# Altium schematic sheet Main.SchDoc
size A4; SheetNumber: 2; SheetTotal: 8
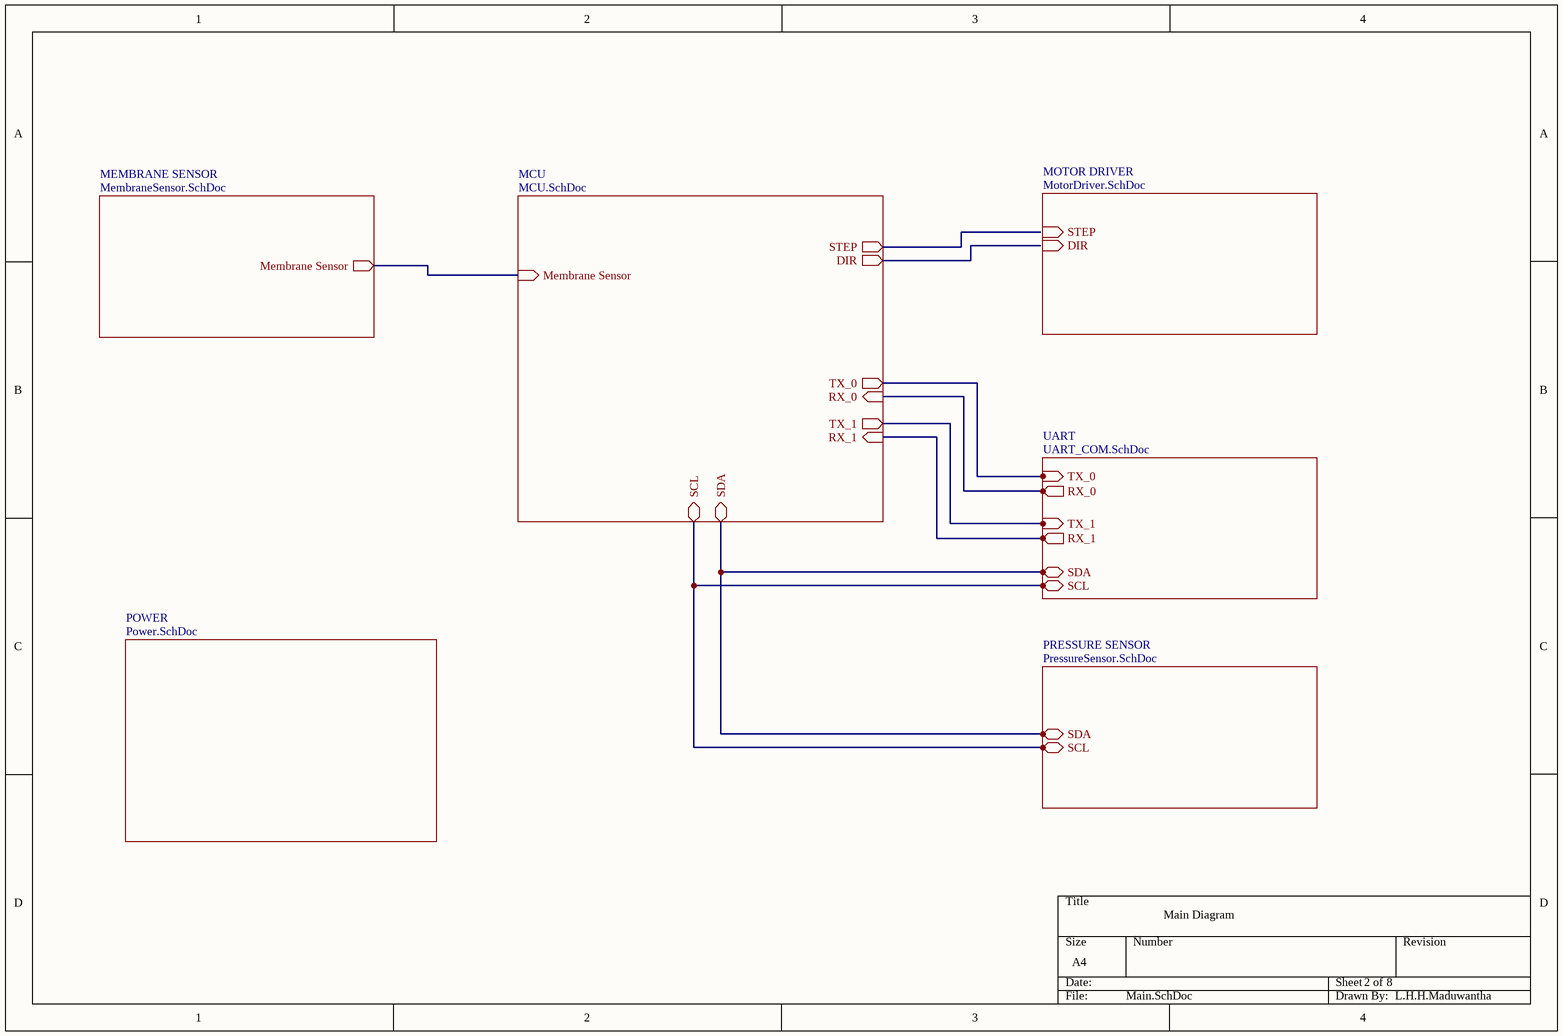
[diagram p0: Main.SchDoc]

## Sub-sheets
MCU = MCU.SchDoc: TX_1 (out), RX_1 (in), TX_0 (out), RX_0 (in), SCL (bidir), SDA (bidir), STEP (out), DIR (out), Membrane Sensor (in)
MEMBRANE SENSOR = MembraneSensor.SchDoc: Membrane Sensor (out)
MOTOR DRIVER = MotorDriver.SchDoc: STEP (in), DIR (in)
POWER = Power.SchDoc: no entries
PRESSURE SENSOR = PressureSensor.SchDoc: SDA (bidir), SCL (bidir)
UART = UART_COM.SchDoc: TX_0 (in), RX_0 (out), SDA (bidir), SCL (bidir), TX_1 (in), RX_1 (out)

## Nets
(unnamed): sheet MCU/TX_1, sheet UART/TX_1
(unnamed): sheet MCU/RX_1, sheet UART/RX_1
(unnamed): sheet MCU/TX_0, sheet UART/TX_0
(unnamed): sheet MCU/RX_0, sheet UART/RX_0
(unnamed): sheet MCU/SCL, sheet PRESSURE SENSOR/SCL, sheet UART/SCL
(unnamed): sheet MCU/SDA, sheet PRESSURE SENSOR/SDA, sheet UART/SDA
(unnamed): sheet MCU/Membrane Sensor, sheet MEMBRANE SENSOR/Membrane Sensor

## Notes on the sheet
- Main Diagram
- L.H.H.Maduwantha